# Altium schematic sheet StepperDriver.SchDoc
size A
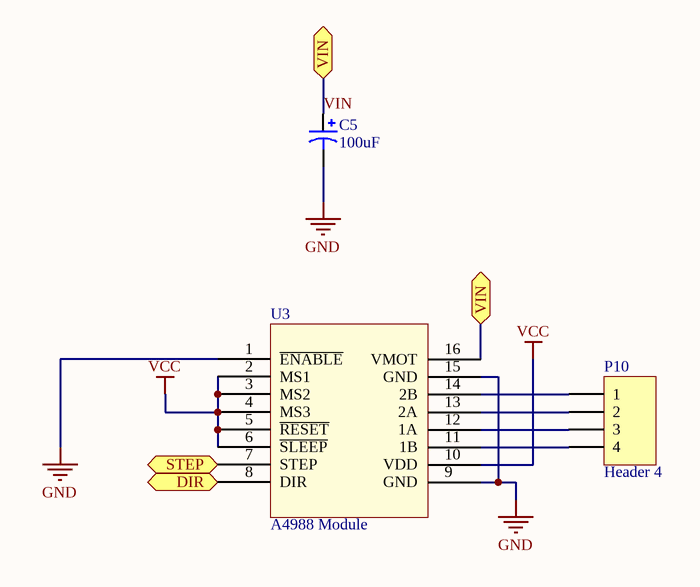
[diagram p0: StepperDriver.SchDoc]

## Parts
C5  value 100uF  [Aluminum Electrolytic Short]  (hidden comment: Cap)
P10  Header 4  [HDR1X4]
U3  A4988 Module  [A4988 Header]

## Ports
DIR, STEP, VIN

## Nets
GND: C5.2 U3.1(~{ENABLE}) U3.9(GND) U3.15(GND)
VCC: U3.2(MS1) U3.3(MS2) U3.4(MS3) U3.5(~{RESET}) U3.6(~{SLEEP}) U3.10(VDD)
DIR: U3.8(DIR) ; port DIR
STEP: U3.7(STEP) ; port STEP
VIN: C5.1 U3.16(VMOT) ; port VIN
NetP10_1: P10.1 U3.14(2B)
NetP10_2: P10.2 U3.13(2A)
NetP10_3: P10.3 U3.12(1A)
NetP10_4: P10.4 U3.11(1B)

## Library data of the parts
C5 = Electrolytic Cap: Manufacturer Part No.: UWT1V101MCL1GS; Vmax: 35V; Digi-Key Part No.: 493-2203-1-ND
P10 = Header 4: Header, 4-Pin; LatestRevisionDate: 17-Jul-2002; LatestRevisionNote: Re-released for DXP Platform.; Publisher: Altium Limited
U3 = A4988 Module: Reference: https://www.pololu.com/product/1182